# EAGLE design CNC-ControlsBoard (EAGLE 6.4)
CNC Control Panel Controls Board reads the MPG encoder displays the turns indicator for the MPG reads the Feed/Speed overrides reads the Keyboard and controls all but 5 of its LEDs displays Spindle Speed and Feed Rate SPI Slave interface to the main MCU
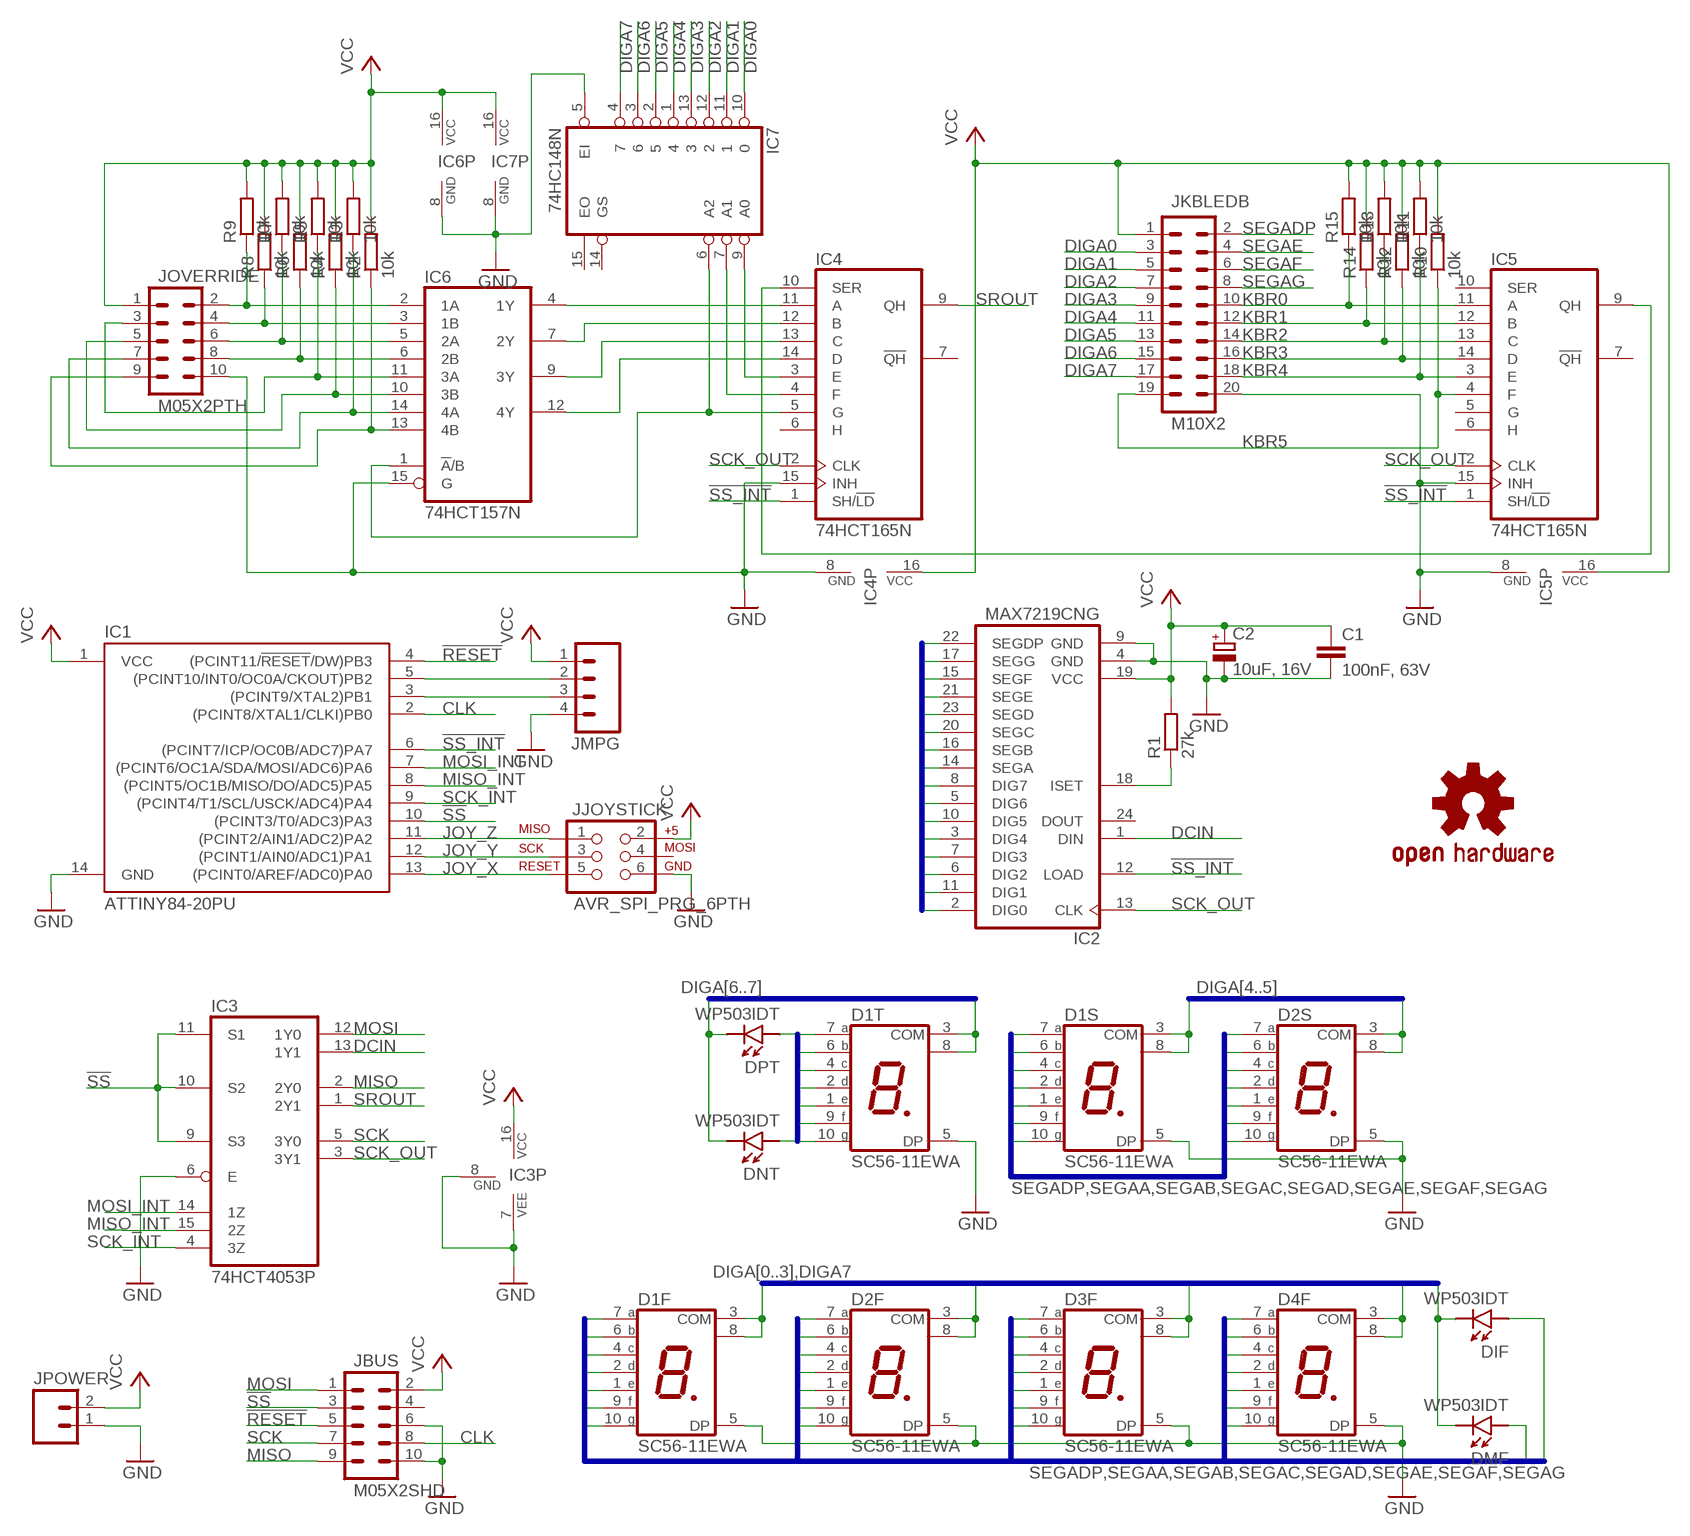
[diagram p0: schematic, sheet 1]

## Parts
C1  100nF, 63V  C-EU050-025X075  [C050-025X075]
C2  10uF, 16V  CPOL-EUE2,5-6E  [E2,5-6E]
D1F  SC56-11EWA  7-SEG_SA52-11  [SA52-11]
D1S  SC56-11EWA  7-SEG_SA52-11  [SA52-11]
D1T  SC56-11EWA  7-SEG_SA52-11  [SA52-11]
D2F  SC56-11EWA  7-SEG_SA52-11  [SA52-11]
D2S  SC56-11EWA  7-SEG_SA52-11  [SA52-11]
D3F  SC56-11EWA  7-SEG_SA52-11  [SA52-11]
D4F  SC56-11EWA  7-SEG_SA52-11  [SA52-11]
DIF  WP503IDT  [AXIAL__GENERIC_SQ_5X5]
DMF  WP503IDT  [AXIAL__GENERIC_SQ_5X5]
DNT  WP503IDT  [AXIAL__GENERIC_SQ_5X5]
DPT  WP503IDT  [AXIAL__GENERIC_SQ_5X5]
IC1  ATTINY84-20PU  [DIL14]
IC2  MAX7219CNG  [DIL24-3]
IC3  74HCT4053P  [DIL16]
IC4  74HCT165N  [DIL16]
IC5  74HCT165N  [DIL16]
IC6  74HCT157N  [DIL16]
IC7  74HC148N  [DIL16]
JBUS  M05X2SHD  [2X5-SHROUDED]
JJOYSTICK  AVR_SPI_PRG_6PTH  [2X3]
JKBLEDB  M10X2  [2X10]
JMPG  M04PTH  [1X04]
JOVERRIDE  M05X2PTH  [AVR_ICSP]
JPOWER  M02POLAR  [MOLEX-1X2]
R1  27k  R-EU_0207/10  [0207/10]
R2  10k  R-EU_0207/10  [0207/10]
R3  10k  R-EU_0207/10  [0207/10]
R4  10k  R-EU_0207/10  [0207/10]
R5  10k  R-EU_0207/10  [0207/10]
R6  10k  R-EU_0207/10  [0207/10]
R7  10k  R-EU_0207/10  [0207/10]
R8  10k  R-EU_0207/10  [0207/10]
R9  10k  R-EU_0207/10  [0207/10]
R10  10k  R-EU_0207/10  [0207/10]
R11  10k  R-EU_0207/10  [0207/10]
R12  10k  R-EU_0207/10  [0207/10]
R13  10k  R-EU_0207/10  [0207/10]
R14  10k  R-EU_0207/10  [0207/10]
R15  10k  R-EU_0207/10  [0207/10]
U$1  SPARKFUN_OSHW-LOGOL  [SPARKFUN_OSHW-LOGO-L]

## Nets
!RESET: IC1.4((PCINT11/!RESET!/DW)PB3) JBUS.5
!SS: IC1.10((PCINT3/T0/ADC3)PA3) IC3.9(S3) IC3.10(S2) IC3.11(S1) JBUS.3
!SS_INT: IC1.6((PCINT7/ICP/OC0B/ADC7)PA7) IC2.12(LOAD) IC4.1(SH/!LD) IC5.1(SH/!LD)
CLK: IC1.2((PCINT8/XTAL1/CLKI)PB0) JBUS.8
DCIN: IC2.1(DIN) IC3.13(1Y1)
DIGA0: D1F.3(COM) D1F.8(COM) IC2.2(DIG0) IC7.10 JKBLEDB.3
DIGA1: D2F.3(COM) D2F.8(COM) IC2.11(DIG1) IC7.11 JKBLEDB.5
DIGA2: D3F.3(COM) D3F.8(COM) IC2.6(DIG2) IC7.12 JKBLEDB.7
DIGA3: D4F.3(COM) D4F.8(COM) IC2.7(DIG3) IC7.13 JKBLEDB.9
DIGA4: D1S.3(COM) D1S.8(COM) IC2.3(DIG4) IC7.1 JKBLEDB.11
DIGA5: D2S.3(COM) D2S.8(COM) IC2.10(DIG5) IC7.2 JKBLEDB.13
DIGA6: D1T.3(COM) D1T.8(COM) IC2.5(DIG6) IC7.3 JKBLEDB.15
DIGA7: DIF.2(K) DMF.2(K) DNT.2(K) DPT.2(K) IC2.8(DIG7) IC7.4 JKBLEDB.17
FOA1: IC6.13(4B) JOVERRIDE.9 R2.1
FOB1: IC6.14(4A) JOVERRIDE.7 R3.1
FOC1: IC6.10(3B) JOVERRIDE.5 R4.1
FOD1: IC6.11(3A) JOVERRIDE.3 R5.1
GND: C1.2 C2.- D1F.5(DP) D1S.5(DP) D1T.5(DP) D2F.5(DP) D2S.5(DP) D3F.5(DP) D4F.5(DP) IC1.14(GND) IC2.4(GND) IC2.9(GND) IC3.6(E) IC3.7(VEE) IC3.8(GND) IC4.8(GND) IC4.15(INH) IC5.8(GND) IC5.15(INH) IC6.8(GND) IC6.15(G) IC7.5(EI) IC7.8(GND) JBUS.6 JBUS.10 JJOYSTICK.6 JKBLEDB.20 JMPG.4 JOVERRIDE.10 JPOWER.1
JOY_X: IC1.13((PCINT0/AREF/ADC0)PA0) JJOYSTICK.5
JOY_Y: IC1.12((PCINT1/AIN0/ADC1)PA1) JJOYSTICK.3
JOY_Z: IC1.11((PCINT2/AIN1/ADC2)PA2) JJOYSTICK.1
KBR0: IC5.11(A) JKBLEDB.10 R15.1
KBR1: IC5.12(B) JKBLEDB.12 R14.1
KBR2: IC5.13(C) JKBLEDB.14 R13.1
KBR3: IC5.14(D) JKBLEDB.16 R12.1
KBR4: IC5.3(E) JKBLEDB.18 R11.1
KBR5: IC5.4(F) JKBLEDB.19 R10.1
MISO: IC3.2(2Y0) JBUS.9
MISO_INT: IC1.8((PCINT5/OC1B/MISO/DO/ADC5)PA5) IC3.15(2Z)
MOSI: IC3.12(1Y0) JBUS.1
MOSI_INT: IC1.7((PCINT6/OC1A/SDA/MOSI/ADC6)PA6) IC3.14(1Z)
N$1: IC4.10(SER) IC5.9(QH)
N$2: IC4.11(A) IC6.4(1Y)
N$3: IC4.12(B) IC6.7(2Y)
N$4: IC1.5((PCINT10/INT0/OC0A/CKOUT)PB2) JMPG.2
N$5: IC1.3((PCINT9/XTAL2)PB1) JMPG.3
N$7: IC4.13(C) IC6.9(3Y)
N$8: IC4.14(D) IC6.12(4Y)
N$9: IC4.3(E) IC7.9(A0)
N$10: IC4.4(F) IC7.7(A1)
N$11: IC4.5(G) IC6.1(!A!/B) IC7.6(A2)
N$22: IC2.18(ISET) R1.1
SCK: IC3.5(3Y0) JBUS.7
SCK_INT: IC1.9((PCINT4/T1/SCL/USCK/ADC4)PA4) IC3.4(3Z)
SCK_OUT: IC2.13(CLK) IC3.3(3Y1) IC4.2(CLK) IC5.2(CLK)
SEGAA: D1F.7(A) D1S.7(A) D1T.7(A) D2F.7(A) D2S.7(A) D3F.7(A) D4F.7(A) DPT.1(A) IC2.14(SEGA)
SEGAB: D1F.6(B) D1S.6(B) D1T.6(B) D2F.6(B) D2S.6(B) D3F.6(B) D4F.6(B) DNT.1(A) IC2.16(SEGB)
SEGAC: D1F.4(C) D1S.4(C) D1T.4(C) D2F.4(C) D2S.4(C) D3F.4(C) D4F.4(C) DIF.1(A) IC2.20(SEGC)
SEGAD: D1F.2(D) D1S.2(D) D1T.2(D) D2F.2(D) D2S.2(D) D3F.2(D) D4F.2(D) DMF.1(A) IC2.23(SEGD)
SEGADP: IC2.22(SEGDP) JKBLEDB.2
SEGAE: D1F.1(E) D1S.1(E) D1T.1(E) D2F.1(E) D2S.1(E) D3F.1(E) D4F.1(E) IC2.21(SEGE) JKBLEDB.4
SEGAF: D1F.9(F) D1S.9(F) D1T.9(F) D2F.9(F) D2S.9(F) D3F.9(F) D4F.9(F) IC2.15(SEGF) JKBLEDB.6
SEGAG: D1F.10(G) D1S.10(G) D1T.10(G) D2F.10(G) D2S.10(G) D3F.10(G) D4F.10(G) IC2.17(SEGG) JKBLEDB.8
SOA1: IC6.6(2B) JOVERRIDE.8 R6.1
SOB1: IC6.5(2A) JOVERRIDE.6 R7.1
SOC1: IC6.3(1B) JOVERRIDE.4 R8.1
SOD1: IC6.2(1A) JOVERRIDE.2 R9.1
SROUT: IC3.1(2Y1) IC4.9(QH)
VCC: C1.1 C2.+ IC1.1(VCC) IC2.19(VCC) IC3.16(VCC) IC4.16(VCC) IC5.16(VCC) IC6.16(VCC) IC7.16(VCC) JBUS.2 JJOYSTICK.2 JKBLEDB.1 JMPG.1 JOVERRIDE.1 JPOWER.2 R1.2 R2.2 R3.2 R4.2 R5.2 R6.2 R7.2 R8.2 R9.2 R10.2 R11.2 R12.2 R13.2 R14.2 R15.2
Unconnected: IC2.24(DOUT) IC4.6(H) IC4.7(!QH) IC5.5(G) IC5.6(H) IC5.7(!QH) IC5.10(SER) IC7.14(GS) IC7.15(EO) JBUS.4 JJOYSTICK.4

## Buses
DIGA[0..7],SEGAA,SEGAB,SEGAC,SEGAD,SEGAE,SEGAF,SEGAG,SEGADP
SEGAA,SEGAB,SEGAC,SEGAD,SEGAE,SEGAF,SEGAG,SEGADP
DIGA[6..7]
DIGA[4..5]
DIGA[0..3],DIGA7
SEGADP,SEGAA,SEGAB,SEGAC,SEGAD,SEGAE,SEGAF,SEGAG

## Library data of the parts
C1 = rcl:C-EU: CAPACITOR, European symbol
C2 = rcl:CPOL-EU: POLARIZED CAPACITOR, European symbol
D1F D1S D1T D2F D2S D3F D4F = display-kingbright:7-SEG_: Kingbright 14.2mm (0.56 INCH) SINGLE DIGIT NUMERIC DUISPLAY Source: SA56-11EWA(Ver1189471036.pdf; OC_FARNELL: unknown; OC_NEWARK: unknown
DIF DMF DNT DPT = radu-collected:WP503*: Kingbright WP503 series 5mm square LEDs
IC1 = SparkFun-DigitalIC-mine:ATTINY84: Atmel 14-pin 2/4/8kB flash uC
IC2 = maxim:MAX7219CNG: LED DISPLAY DRIVER; MF: MAXIM; MPN: MAX7219CNG; OC_FARNELL: 1523914; OC_NEWARK: 34C4018
IC3 = 74xx-eu:74*4053: Triple 2-channel analog multiplexer/demultiplexer Philips Semiconductor
IC4 IC5 = 74xx-eu:74*165: 8-bit parallel load SHIFT REGISTER
IC6 = 74xx-eu:74*157: Quadruple 2-line to 1-line data SELECTOR/MULTIPLEXER
IC7 = 74xx-eu:74*148: 10-line to 4-line and 8-line to 3-line PRIORITY ENCODER
JBUS JOVERRIDE = SparkFun-Connectors:M05X2: Header 5x2 Standard 10-pin dual row 0.1" header. Commonly used with AVR-ISP. Use with Spark Fun Electronics SKU: PRT-00778
JJOYSTICK = SparkFun-Connectors:AVR_SPI_PRG_6: AVR ISP 6 Pin This is the reduced ISP connector for AVR programming. Common on Arduino. This footprint will take up less PCB space and can be used with a 10-pin to 6-pin adapter such as SKU: BOB-08508
JKBLEDB = SparkFun-Connectors:M10X2: This was SPECIALLY designed to be used with our Graphic LCD Backpack. Be sure you want to use this! It is not only staggered on each line of header holes, but IT IS ALSO offset of the center point of the top and bottom lines by 5 mil. This causes the headers to lock into place on the "standard" footprint on the LCD screen. The extra squares on the tdocu layer are there simply to reference other pins (if you were to actually populate a longer header than ten long - this is what we do with the backpacks).
JMPG = SparkFun-Connectors:M04: Header 4 Standard 4-pin 0.1" header. Use with straight break away headers (SKU : PRT-00116), right angle break away headers (PRT-00553), swiss pins (PRT-00743), machine pins (PRT-00117), and female headers (PRT-00115). Molex polarized connector foot print use with SKU : PRT-08231 with associated crimp pins and housings. 1MM SMD Version SKU: PRT-10208
JPOWER = SparkFun-Connectors:M02: Header 2 Standard 2-pin 0.1" header. Use with straight break away headers (SKU : PRT-00116), right angle break away headers (PRT-00553), swiss pins (PRT-00743), machine pins (PRT-00117), and female headers (PRT-00115). Molex polarized connector foot print use with SKU : PRT-08233 with associated crimp pins and housings.
R1-R15 = rcl:R-EU_: RESISTOR, European symbol
U$1 = Si4735_Breakout-v10:SPARKFUN_OSHW-LOGO: Open Source Hardware Logo This logo indicates the piece of hardware it is found on incorporates a OSHW license and/or adheres to the definition of open source hardware found here: http://freedomdefined.org/OSHW

## Net classes
1 Power: width 1.27 mm

## Board
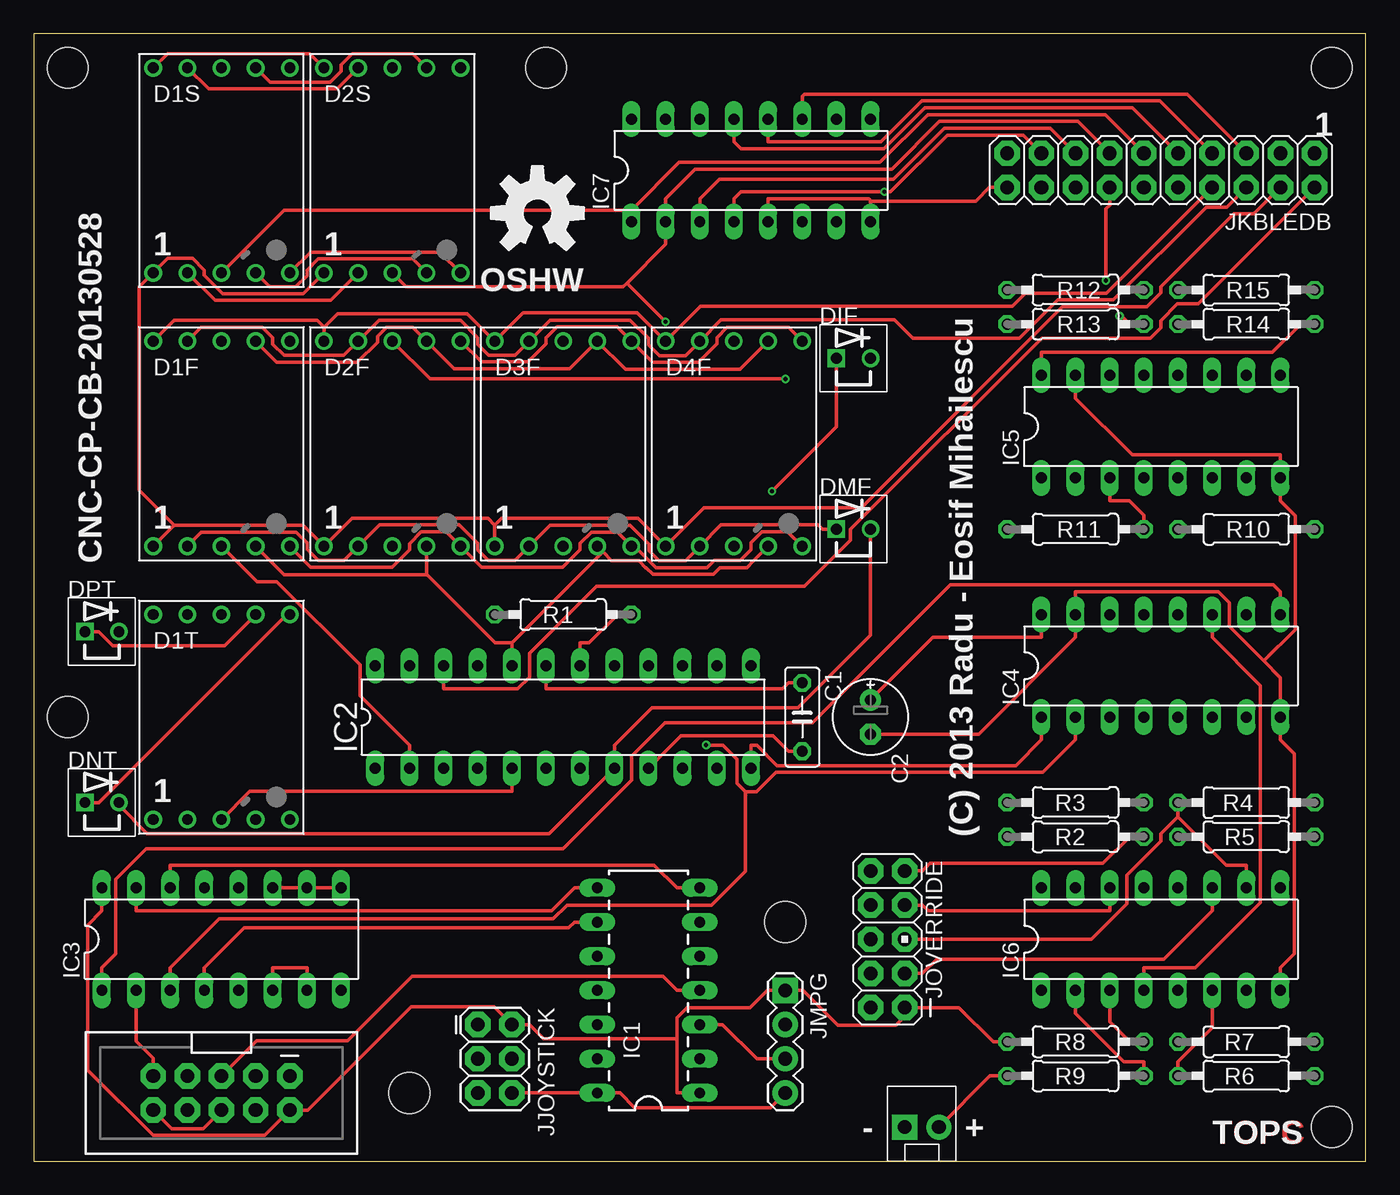
[diagram p1: board, top side]
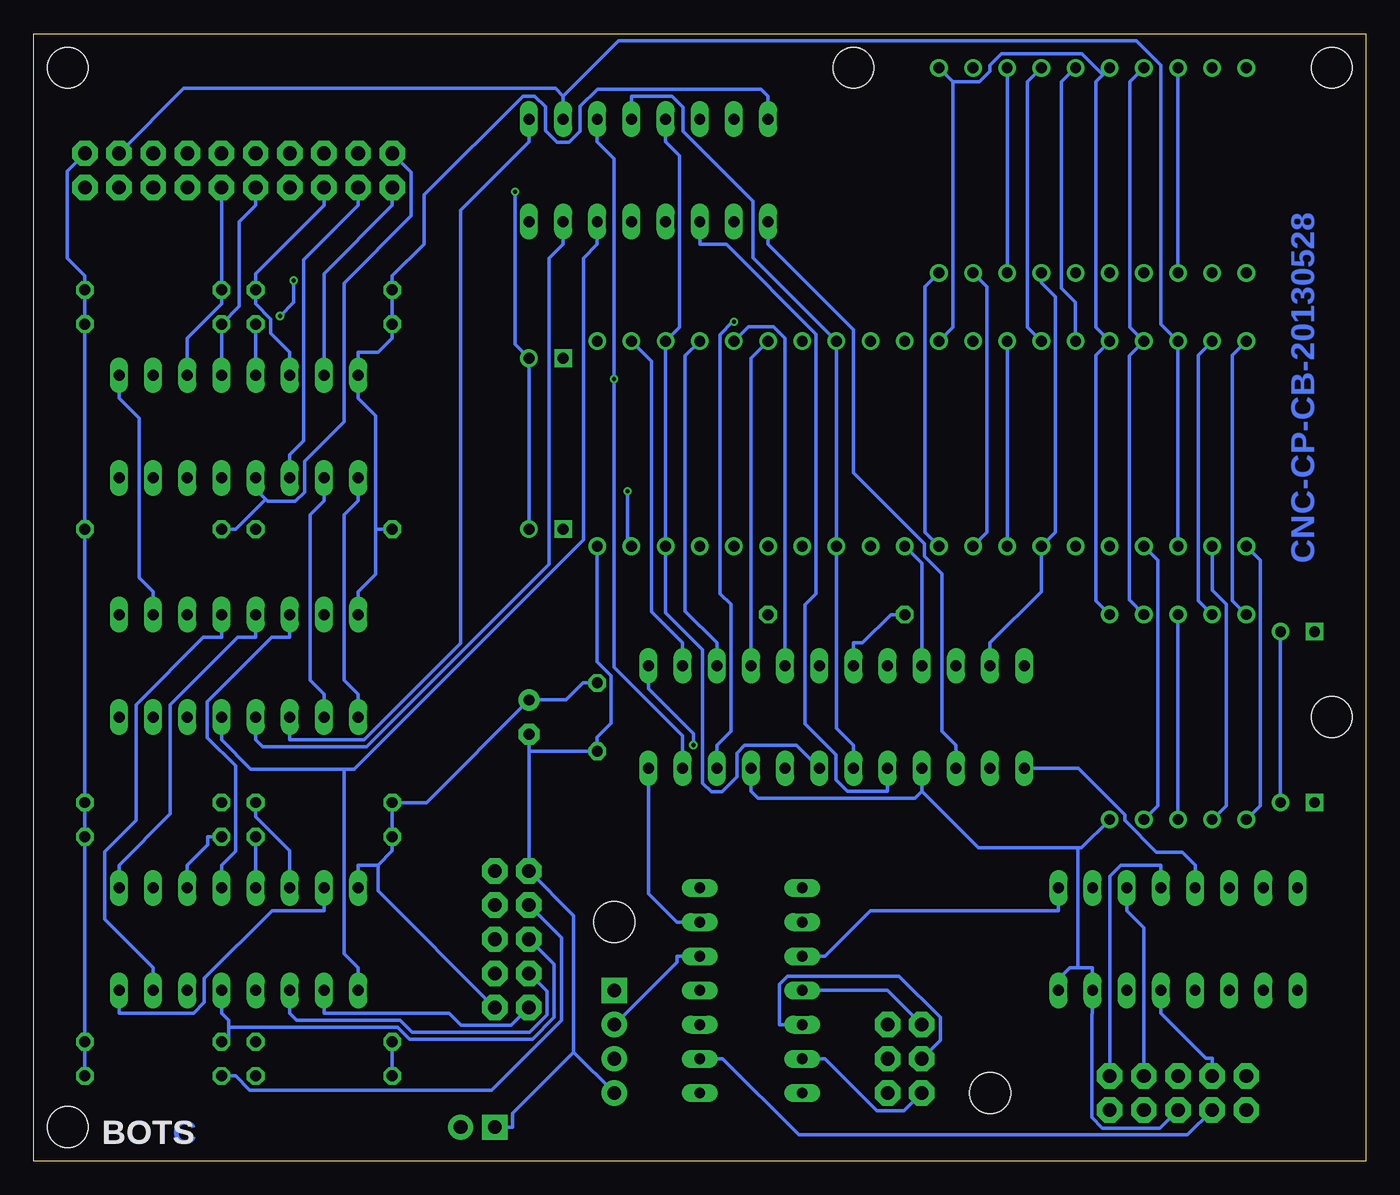
[diagram p2: board, bottom side, seen from below]

Size 99.06 x 83.82 mm. Coordinates in mm from the lower left corner, seen from the top.
Outline: 0,0 99.06,0 99.06,83.82 0,83.82 0,0
Copper layers (1*16): Top 0.035mm / dielectric 1.5mm / Bottom 0.035mm
Design rules "ITEADstudio_DRC": minimum track width 10mil, minimum drill 12mil, track to track 10mil, track to pad 10mil, pad to pad 10mil, via to via 10mil, smd to smd 0mil, copper to edge 20mil, drill to drill 10mil, minimum pad ring 10mil, minimum via ring 6mil, stop-mask expansion 4mil, vias tented up to drill 100mil, thermal gap 10mil
Holes 3.05 mm at 96.52,81.28 96.52,2.54 2.54,33.02 2.54,81.28 27.94,5.08 55.88,17.78 38.1,81.28

### Footprints (pad centres in the part's own frame; a part is rotated, then mirrored left to right if it is on the bottom)
C050-025X075 = drill 0.813 octagon: 1 -2.54,0; 2 2.54,0
E2,5-6E = drill 0.813 pad 1.575: + -1.27,0 | drill 0.813 pad 1.575 octagon: - 1.27,0
SA52-11 = drill 0.8: 1 -5.08,-7.62; 2 -2.54,-7.62; 3 0,-7.62; 4 2.54,-7.62; 5 5.08,-7.62; 6 5.08,7.62; 7 2.54,7.62; 8 0,7.62; 9 -2.54,7.62; 10 -5.08,7.62
AXIAL__GENERIC_SQ_5X5 = drill 0.8 square: 1 -1.27,0 | drill 0.8: 2 1.27,0
DIL14 = drill 0.813 long: 1 -8.89,-3.81; 2 -6.35,-3.81; 3 -3.81,-3.81; 4 -1.27,-3.81; 5 1.27,-3.81; 6 3.81,-3.81; 7 6.35,-3.81; 8 6.35,3.81; 9 3.81,3.81; 10 1.27,3.81; 11 -1.27,3.81; 12 -3.81,3.81; 13 -6.35,3.81; 14 -8.89,3.81
DIL24-3 = drill 0.813 long: 1 -13.97,-3.81; 2 -11.43,-3.81; 3 -8.89,-3.81; 4 -6.35,-3.81; 5 -3.81,-3.81; 6 -1.27,-3.81; 7 1.27,-3.81; 8 3.81,-3.81; 9 6.35,-3.81; 10 8.89,-3.81; 11 11.43,-3.81; 12 13.97,-3.81; 13 13.97,3.81; 14 11.43,3.81; 15 8.89,3.81; 16 6.35,3.81; 17 3.81,3.81; 18 1.27,3.81; 19 -1.27,3.81; 20 -3.81,3.81; 21 -6.35,3.81; 22 -8.89,3.81; 23 -11.43,3.81; 24 -13.97,3.81
DIL16 = drill 0.813 long: 1 -8.89,-3.81; 2 -6.35,-3.81; 3 -3.81,-3.81; 4 -1.27,-3.81; 5 1.27,-3.81; 6 3.81,-3.81; 7 6.35,-3.81; 8 8.89,-3.81; 9 8.89,3.81; 10 6.35,3.81; 11 3.81,3.81; 12 1.27,3.81; 13 -1.27,3.81; 14 -3.81,3.81; 15 -6.35,3.81; 16 -8.89,3.81
2X5-SHROUDED = drill 1.016 pad 1.88 octagon: 1 -1.27,5.08; 2 1.27,5.08; 3 -1.27,2.54; 4 1.27,2.54; 5 -1.27,0; 6 1.27,0; 7 -1.27,-2.54; 8 1.27,-2.54; 9 -1.27,-5.08; 10 1.27,-5.08
2X3 = drill 1.016 pad 1.88 octagon: 1 0,0; 2 0,2.54; 3 2.54,0; 4 2.54,2.54; 5 5.08,0; 6 5.08,2.54
2X10 = drill 1.016 pad 1.88 octagon: 1 -11.43,-1.27; 2 -11.43,1.27; 3 -8.89,-1.27; 4 -8.89,1.27; 5 -6.35,-1.27; 6 -6.35,1.27; 7 -3.81,-1.27; 8 -3.81,1.27; 9 -1.27,-1.27; 10 -1.27,1.27; 11 1.27,-1.27; 12 1.27,1.27; 13 3.81,-1.27; 14 3.81,1.27; 15 6.35,-1.27; 16 6.35,1.27; 17 8.89,-1.27; 18 8.89,1.27; 19 11.43,-1.27; 20 11.43,1.27
1X04 = drill 1.016 pad 1.88 square: 1 0,0 | drill 1.016 pad 1.88: 2 2.54,0; 3 5.08,0; 4 7.62,0
AVR_ICSP = drill 1.016 pad 1.88 octagon: 1 -1.27,5.08; 2 1.27,5.08; 3 -1.27,2.54; 4 1.27,2.54; 5 -1.27,0; 6 1.27,0; 7 -1.27,-2.54; 8 1.27,-2.54; 9 -1.27,-5.08; 10 1.27,-5.08
MOLEX-1X2 = drill 1.016 pad 1.88 square: 1 0,0 | drill 1.016 pad 1.88: 2 2.54,0
0207/10 = drill 0.813 octagon: 1 -5.08,0; 2 5.08,0

### Placement (x,y rotation side)
C1  57.15,33.02 270 top
C2  62.23,33.02 270 top
D1F  13.97,53.34 0 top
D1S  13.97,73.66 0 top
D1T  13.97,33.02 0 top
D2F  26.67,53.34 0 top
D2S  26.67,73.66 0 top
D3F  39.37,53.34 0 top
D4F  52.07,53.34 0 top
DIF  60.96,59.69 0 top
DMF  60.96,46.99 0 top
DNT  5.08,26.67 0 top
DPT  5.08,39.37 0 top
IC1  45.72,13.97 90 top
IC2  39.37,33.02 0 top
IC3  13.97,16.51 0 top
IC4  83.82,36.83 0 top
IC5  83.82,54.61 0 top
IC6  83.82,16.51 0 top
IC7  53.34,73.66 0 top
JBUS  13.97,5.08 270 top
JJOYSTICK  33.02,10.16 270 top
JKBLEDB  83.82,73.66 180 top
JMPG  55.88,12.7 270 top
JOVERRIDE  63.5,16.51 180 top
JPOWER  64.77,2.54 0 top
R1  39.37,40.64 180 top
R2  77.47,24.13 180 top
R3  77.47,26.67 180 top
R4  90.17,26.67 0 top
R5  90.17,24.13 0 top
R6  90.17,6.35 0 top
R7  90.17,8.89 0 top
R8  77.47,8.89 180 top
R9  77.47,6.35 180 top
R10  90.17,46.99 0 top
R11  77.47,46.99 180 top
R12  77.47,64.77 180 top
R13  77.47,62.23 180 top
R14  90.17,62.23 0 top
R15  90.17,64.77 0 top
U$1  37.47,70.48 0 top

### Tracks (layer width: path | path; a pad name or v marks a point on that pad's centre or on a via)
!RESET
  Top 0.254: IC1.4 47.83,12.7 46.79,13.74 28.13,13.74 23.34,8.95 16.57,8.95 JBUS.5
!SS
  Top 0.254: IC3.9 IC3.10 IC3.11
  Bottom 0.254: IC1.10 40.21,15.24 36.83,18.62 22.86,18.62 IC3.9 | IC3.11 17.78,18.62 16.51,17.35 JBUS.3
!SS_INT
  Top 0.254: IC2.12 53.34,30.91 53.77,30.91 55.27,29.41 73.03,29.41 74.93,31.32 IC4.1
  Bottom 0.254: IC4.1 74.93,34.72 75.97,35.76 75.97,48.06 74.93,49.1 IC5.1 | IC1.6 51.23,17.78 53.34,19.89 IC2.12
CLK
  Bottom 0.254: JBUS.8 13.28,1.96 42.17,1.96 47.83,7.62 IC1.2
DCIN
  Bottom 0.254: IC3.13 12.7,22.02 13.66,22.98 15.57,22.98 17.93,25.34 17.93,25.74 21.4,29.21 IC2.1
DIGA0
  Top 0.254: IC2.2 27.94,30.91 24.26,34.59 24.26,36.89 18.07,43.08 16.61,43.08 D1F.3
  Bottom 0.254: JKBLEDB.3 87.9,79.74 60.26,79.74 59.69,79.17 | 59.69,79.17 55.56,83.3 17.06,83.3 15.24,81.48 15.24,62.23 D1F.8 D1F.3 | 59.69,79.17 59.69,79.05 IC7.10
DIGA1  (via drill 0.3 pad 0.61)
  Top 0.254: JKBLEDB.5 85.77,79.33 57.31,79.33 57.15,79.17 IC7.11 | v55.89,58.15 29.48,58.15 D2F.8
  Bottom 0.254: D2F.8 D2F.3 | IC7.11 57.15,75.77 55.89,74.51 v55.89,58.15 55.89,36.72 50.8,31.63 50.8,30.91 IC2.11
DIGA2
  Top 0.254: JKBLEDB.7 83.74,78.82 66.06,78.82 63.02,75.77 54.61,75.77 IC7.12
  Bottom 0.254: IC2.6 38.1,30.91 39.37,32.18 D3F.3 D3F.8 45.56,67.16 45.56,71.36 50.77,76.56 50.77,78.34 51.61,79.17 54.61,79.17 IC7.12
DIGA3
  Top 0.254: JKBLEDB.9 81.71,78.31 66.28,78.31 63.22,75.26 52.58,75.26 52.07,75.77 IC7.13
  Bottom 0.254: IC2.7 42.34,30.91 46.2,30.91 46.77,30.35 46.77,28.57 47.88,27.46 48.67,27.46 49.32,28.11 49.32,38.02 52.07,40.77 D4F.3 D4F.8 51.03,62 51.03,74.73 52.07,75.77 IC7.13
DIGA4
  Top 0.254: 44.45,70.7 18.63,70.7 D1S.3 | JKBLEDB.11 79.68,77.8 66.49,77.8 62.93,74.24 47.99,74.24 44.45,70.7 | IC7.1 44.45,70.7
  Bottom 0.254: IC7.1 44.45,68.15 38.1,61.8 38.1,51.17 32.84,45.91 32.84,44.99 31.52,43.67 31.52,31.95 30.48,30.91 IC2.3 | D1S.8 D1S.3
DIGA5  (via drill 0.3 pad 0.61)
  Top 0.254: JKBLEDB.13 77.65,77.29 67.36,77.29 63.8,73.74 49.17,73.74 46.99,71.55 IC7.2 46.99,68.15 44.12,65.28 | 44.12,65.28 43.84,65 27.71,65 D2S.3 | 44.12,65.28 v46.99,62.4
  Bottom 0.254: IC2.10 48.26,30.91 47.21,31.96 47.21,41.39 48.02,42.2 48.02,61.46 47.08,62.4 v46.99,62.4 | D2S.8 D2S.3
DIGA6
  Top 0.254: JKBLEDB.15 75.61,76.78 67.73,76.78 63.95,73 50.98,73 49.53,71.55 IC7.3 | IC2.5 35.56,27.51 16.08,27.51 D1T.3
  Bottom 0.254: IC2.5 35.56,27.51 38.54,27.51 39.41,28.38 39.41,30.21 41.72,32.52 41.72,41.36 40.87,42.21 40.87,61.47 47.55,68.15 49.53,68.15 IC7.3 | D1T.8 D1T.3
DIGA7  (via drill 0.3 pad 0.61)
  Top 0.254: DNT.2 6.35,26.45 8.46,24.34 38.31,24.34 IC2.8 43.18,30.91 45.98,33.71 56.82,33.71 62.23,39.12 DMF.2 | JKBLEDB.17 73.58,76.28 67.94,76.28 63.73,72.06 v63.27,72.06 52.58,72.06 52.07,71.55 IC7.4
  Bottom 0.254: DNT.2 DPT.2 | v63.27,72.06 63.27,60.73 DIF.2 DMF.2
FOA1
  Top 0.254: JOVERRIDE.9 66.09,21.59 66.64,22.14 79.52,22.14 81.51,24.13 R2.1
  Bottom 0.254: R2.1 IC6.13
FOB1
  Top 0.254: JOVERRIDE.7 66.09,19.05 66.52,18.62 80.01,18.62 IC6.14
  Bottom 0.254: R3.1 82.55,25.63 80.01,23.09 IC6.14
FOC1
  Top 0.254: JOVERRIDE.5 78.65,16.51 81.28,19.14 81.28,21.27 83.82,23.81 83.82,24.36 85.09,25.63 | IC6.10 90.17,22.02 88.7,22.02 85.09,25.63 | R4.1 85.09,25.63
FOD1
  Top 0.254: JOVERRIDE.3 66.09,13.97 67.15,15.03 84.04,15.03 87.63,18.62 IC6.11
  Bottom 0.254: R5.1 86.13,24.13 86.13,23.52 87.63,22.02 IC6.11
GND
  Top 0.254: IC2.9 48.14,31.63 54.96,31.63 56.11,30.48 C1.2 | D4F.5 56.07,46.8 54.17,46.8 53.34,45.97 53.34,45.47 52.55,44.69 50.63,44.69 50.08,44.14 46.28,44.14 44.69,45.72 D3F.5 43.41,46.77 41.47,46.77 40.64,45.94 40.64,45.47 39.34,44.17 33.3,44.17 D2F.5 30.68,46.79 28.82,46.79 27.94,45.92 27.94,45.44 26.65,44.16 20.61,44.16 D1F.5 | IC5.15 77.47,56.72 81.69,52.5 92.71,52.5 IC5.8 92.71,50.42 92.71,49.1 93.81,48 93.81,39.53 91.47,37.19 | 91.47,37.19 92.71,35.95 IC4.8 92.71,31.32 93.75,30.28 93.75,15.44 92.71,14.4 IC6.8 | 91.47,37.19 88.9,39.76 88.9,41.53 88.09,42.34 77.47,42.34 IC4.15 77.47,40.26 77.47,38.94 70.28,31.75 63.4,31.75 C2.- | 62.23,71.42 62.28,71.37 70.05,71.37 71.07,72.39 JKBLEDB.20 | IC7.5 54.61,71.55 62.1,71.55 62.23,71.42 | IC7.8 62.23,71.42 | JMPG.4 54.8,4 44.69,4 43.61,5.08 IC1.14 JJOYSTICK.6 | D2S.5 30.2,67.58 20.6,67.58 D1S.5 | IC3.6 17.78,14.4 20.32,14.4 IC3.7 | JBUS.10 10.26,2.44 12.6,2.44 JBUS.6
  Bottom 0.254: IC6.15 77.47,18.62 81.34,18.62 86.36,13.6 86.36,11.81 87.17,11 92.71,11 IC6.8 | 21.4,23.29 28.8,23.29 33.02,27.51 | 21.4,23.29 21.16,23.29 D1T.5 | 21.4,14.4 21.4,23.29 | 33.02,27.51 33.53,27 45.21,27 45.72,27.51 IC2.9 | IC2.4 33.02,27.51 | 21.4,14.4 20.32,14.4 IC3.7 20.32,11 20.38,10.94 20.38,3.26 19.59,2.47 15.31,2.47 JBUS.6 | 21.4,14.4 22.01,14.4 22.86,13.55 IC3.8 | D2S.5 32.79,65 32.79,46.76 D2F.5 | IC5.15 77.47,65.99 72.39,71.07 JKBLEDB.20 | 62.23,30.48 62.23,30.58 C2.- | 62.23,30.48 JOVERRIDE.10 58.91,18.27 58.91,8.11 | 62.23,30.48 C1.2 57.15,31.52 56.11,32.56 56.11,36.09 57.15,37.13 D4F.5 | JPOWER.1 63.45,2.54 63.45,3.56 58.91,8.11 | JMPG.4 58.91,8.11
JOY_X
  Bottom 0.254: IC1.13 40.21,7.62 36.34,3.75 34.35,3.75 JJOYSTICK.5
JOY_Y
  Bottom 0.254: IC1.12 43.61,10.16 43.61,13.15 43,13.76 34.71,13.76 31.64,10.69 31.64,8.99 JJOYSTICK.3
JOY_Z
  Bottom 0.254: JJOYSTICK.1 35.56,12.7 IC1.11
KBR0
  Bottom 0.254: IC5.11 87.63,61.19 85.09,63.73 R15.1 JKBLEDB.10
KBR1
  Bottom 0.254: JKBLEDB.12 82.55,71.07 83.77,69.85 83.77,63.55 R14.1 85.09,60.12 IC5.12
KBR2  (via drill 0.3 pad 0.61)
  Top 0.254: v79.73,65.47 79.73,70.79 80.01,71.07 JKBLEDB.14 | v79.73,65.47 | R13.1 81.51,62.23 80.91,62.83 v80.74,62.83
  Bottom 0.254: v80.74,62.83 79.73,63.84 v79.73,65.47 | IC5.13 R13.1
KBR3
  Bottom 0.254: IC5.14 80.01,60.12 81.43,61.54 81.43,62.61 82.55,63.73 R12.1 82.55,65.81 82.55,65.99 77.47,71.07 JKBLEDB.16
KBR4
  Top 0.254: IC5.3 80.01,49.1 81.48,49.1 82.55,48.03 R11.1
  Bottom 0.254: JKBLEDB.18 74.93,71.07 78.97,67.03 78.97,53.54 80.01,52.5 IC5.3
KBR5
  Bottom 0.254: 81.82,49.22 81.65,49.05 79.62,49.05 78.92,49.75 78.92,52.04 75.99,54.97 75.99,65.27 70.99,70.27 70.99,73.53 JKBLEDB.19 | 81.82,49.22 82.34,49.74 82.55,49.95 IC5.4 | 81.82,49.22 84.05,46.99 R10.1
MISO
  Top 0.254: JBUS.9 8.89,7.67 7.62,8.94 IC3.2
MISO_INT
  Top 0.254: IC1.8 40.21,20.32 38.51,18.62 7.62,18.62 IC3.15
MOSI
  Bottom 0.254: IC3.12 15.24,22.02 18.21,22.02 19.05,21.19 JBUS.1
MOSI_INT
  Top 0.254: IC1.7 47.83,20.32 46.13,22.02 10.16,22.02 IC3.14
N$1
  Bottom 0.254: IC4.10 90.17,42.34 91.21,43.38 91.21,55.22 92.71,56.72 IC5.9
N$2
  Top 0.254: IC4.11 87.63,38.94 91.22,35.34 91.22,19.23 86.39,14.4 82.55,14.4 IC6.4
N$3
  Bottom 0.254: IC4.12 85.09,38.94 86.44,38.94 91.44,33.94 91.44,25.34 93.76,23.02 93.76,17.99 90.17,14.4 IC6.7
N$4
  Bottom 0.254: IC1.5 51.23,15.24 51.23,14.81 JMPG.2
N$5
  Top 0.254: IC1.3 51.23,10.16 53.77,7.62 JMPG.3
N$7
  Bottom 0.254: IC4.13 82.55,38.94 83.9,38.94 88.9,33.94 88.9,25.83 92.71,22.02 IC6.9
N$8
  Bottom 0.254: IC4.14 80.01,38.94 81.36,38.94 86.14,34.16 86.14,31.48 84.05,29.39 84.05,23.06 85.09,22.02 IC6.12
N$9
  Bottom 0.254: IC4.3 80.01,31.32 74.5,31.32 67.31,38.51 67.31,70.69 62.23,75.77 IC7.9
N$10
  Bottom 0.254: IC4.4 82.55,31.32 82.04,30.81 74.29,30.81 60.73,44.37 60.73,67.11 59.69,68.15 IC7.7
N$11
  Bottom 0.254: 75.97,29.16 75.22,29.16 58.19,46.19 58.19,67.11 57.15,68.15 IC7.6 | 75.97,29.16 82.93,29.16 85.09,31.32 IC4.5 | 75.97,29.16 75.97,15.44 74.93,14.4 IC6.1
N$22
  Top 0.254: IC2.18 40.64,38.53 41.3,38.53 43.41,40.64 R1.1
SCK
  Bottom 0.254: JBUS.7 11.43,7.67 11.91,7.67 15.24,11 IC3.5
SCK_INT
  Top 0.254: IC1.9 40.21,17.78 39.78,17.35 15.65,17.35 12.7,14.4 IC3.4
SCK_OUT  (via drill 0.3 pad 0.61)
  Top 0.254: 52.93,27.47 52.3,28.1 52.3,29.9 51.26,30.94 v50.01,30.94 | IC4.2 77.47,31.32 75.06,28.91 55.18,28.91 53.74,27.47 52.93,27.47 | IC3.3 10.16,14.4 13.79,18.03 38.64,18.03 39.66,19.05 50.4,19.05 52.93,21.58 52.93,27.47
  Bottom 0.254: v50.01,30.94 50.01,31.8 53.34,35.13 IC2.13 | IC4.2 77.47,34.72 78.51,35.76 78.51,48.06 77.47,49.1 IC5.2
SEGAA
  Top 0.254: D4F.7 52.53,58.88 43.99,58.88 D3F.7 39.86,58.91 31.26,58.91 D2F.7 28.17,62 26.24,62 25.57,61.32 25.57,60.88 24.07,59.39 18.08,59.39 D1F.7 | DPT.1 4.84,39.37 5.88,38.34 14.21,38.34 D1T.7 | D2S.7 28.16,82.33 23.68,82.33 22.86,81.51 22.86,81.03 22.04,80.21 17.58,80.21 D1S.7
  Bottom 0.254: IC2.14 50.8,38.53 53.1,40.84 53.1,59.45 D4F.7 | D1S.7 17.55,80.24 17.55,62 D1F.7 17.59,59.88 17.59,41.72 D1T.7
SEGAB
  Top 0.254: D4F.6 56.11,62 51.57,62 50.8,61.23 50.8,60.76 49.43,59.38 46.02,59.38 D3F.6 43.39,62.02 38.91,62.02 38.1,61.21 38.1,60.76 36.75,59.41 33.3,59.41 D2F.6 | DNT.1 4.84,26.67 18.82,40.64 D1T.6
  Bottom 0.254: IC2.16 45.72,59.69 D3F.6 | 30.71,80.24 D2S.6 | D2F.6 30.71,62 30.71,80.24 | 30.71,80.24 28.72,80.24 27.94,81.02 27.94,81.49 27.11,82.32 21.13,82.32 19.57,80.76 | 19.57,80.76 D1S.6 | 19.57,80.76 20.09,80.24 20.09,62 D1F.6 20.09,59.92 20.09,41.68 D1T.6
SEGAC  (via drill 0.3 pad 0.61)
  Top 0.254: 42.33,45.3 42.99,44.64 45,44.64 45.51,44.14 45.55,44.14 46.06,43.63 50.54,43.63 51.05,44.14 53.02,44.14 53.53,44.64 D4F.4 | 29.21,43.65 29.15,43.59 18.64,43.59 D1F.4 | 29.21,43.65 34.33,38.53 35.56,38.53 | D2F.4 29.21,43.65 | v54.9,49.8 59.69,54.59 DIF.1 | 42.33,45.3 D3F.4 | 42.33,45.3 35.56,38.53 | IC2.20 35.56,38.53 | D1S.4 17.55,65 19.49,65 20.32,65.83 20.32,66.24 21.16,67.08 28.17,67.08 D2S.4
  Bottom 0.254: D1T.4 15.47,26.44 15.47,44.68 D1F.4 | D4F.4 54.9,46.01 v54.9,49.8 | D2F.4 28.17,46.76 28.17,65 D2S.4
SEGAD
  Top 0.254: DMF.1 58.66,46.99 58.34,47.31 51.12,47.31 D4F.2 48.45,44.64 46.52,44.64 45.77,45.39 45.77,45.87 44.36,47.27 38.38,47.27 D3F.2 35.79,44.68 33.8,44.68 33.02,45.46 33.02,45.93 31.65,47.3 25.71,47.3 D2F.2 23.08,44.67 21.15,44.67 20.32,45.49 20.32,45.97 19.53,46.76 12.47,46.76 D1F.2 | D1S.2 13.48,63.99 22.08,63.99 D2S.2
  Bottom 0.254: IC2.23 27.94,38.53 24.13,42.34 D2F.2 23.09,46.76 23.09,64.28 24.13,65.32 D2S.2 | D1F.2 11.43,42.46 10.39,41.42 10.39,26.44 D1T.2
SEGADP
  Top 0.254: IC2.22 30.48,35.13 36,35.13 36.87,35.99 36.87,37.76 41.87,42.76 57.33,42.76 60.74,46.17 60.74,46.97 74.95,61.18 83.02,61.18 83.82,61.97 83.82,62.49 85.05,63.73 86.59,63.73 JKBLEDB.2
SEGAE
  Top 0.254: 34.29,47.3 34.78,47.78 44.93,47.78 D4F.1 49.84,48.57 61.56,48.57 76.51,63.52 82.77,63.52 83.82,64.56 83.82,64.99 89.24,70.41 90.73,70.41 JKBLEDB.4 | 34.29,47.3 33.77,47.81 23.68,47.81 D2F.1 20.04,47.27 10.44,47.27 | D3F.1 34.29,47.3 | D1F.1 10.44,47.27 | 10.44,47.27 7.84,49.86 7.84,64.99 D1S.1 9.96,67.11 11.84,67.11 12.7,66.25 12.7,65.84 14.05,64.5 20.05,64.5 D2S.1
  Bottom 0.254: IC2.21 33.02,38.53 33.02,44.45 D3F.1 | D1T.1 7.84,26.45 7.84,44.67 D1F.1
SEGAF
  Top 0.254: D1F.9 12.47,62 17.01,62 17.78,61.23 17.78,60.74 18.62,59.9 23.07,59.9 D2F.9 25.68,62.51 31.74,62.51 33.02,61.23 33.02,60.75 33.85,59.92 35.79,59.92 D3F.9 38.4,62.53 44.36,62.53 45.72,61.17 45.72,60.71 46.54,59.89 48.46,59.89 D4F.9 51.13,62.56 64,62.56 65.37,61.18 73.31,61.18 76.14,64.02 80.29,64.02 87.19,70.92 88.7,70.92 JKBLEDB.6 | D1S.9 13.01,79.7 22.55,79.7 D2S.9
  Bottom 0.254: D2S.9 25.17,80.24 25.17,62 D2F.9 | D1T.9 12.47,41.68 12.47,59.92 D1F.9 | D4F.9 50.61,59.88 50.61,40.88 48.26,38.53 IC2.15
SEGAG
  Top 0.254: JKBLEDB.8 79.77,64.53 73.73,64.53 72.77,63.57 49.6,63.57 D4F.10 44.88,63.07 36.4,63.07 D3F.10 32.24,63.01 22.6,63.01 21.59,62 | 21.59,62 21.08,62.51 10.44,62.51 D1F.10 | 21.59,62 D2F.10 | D2S.10 20.53,82.34 9.95,82.34 D1S.10
  Bottom 0.254: IC2.17 43.18,38.53 43.18,61.16 44.05,62.04 45.91,62.04 D4F.10 | D2S.10 22.64,80.23 22.64,64.91 21.59,63.86 D2F.10 | D1F.10 9.93,59.92 9.93,41.68 D1T.10
SOA1
  Top 0.254: R6.1 85.09,7.39 87.63,9.93 IC6.6
  Bottom 0.254: R6.1 84.05,6.35 82.99,5.29 65.02,5.29 59.81,10.5 59.81,16.63 JOVERRIDE.8
SOB1
  Bottom 0.254: 84.57,9.96 71.98,9.96 71.11,9.09 61.98,9.09 60.38,10.69 60.38,14.66 JOVERRIDE.6 | 84.57,9.96 84.57,10.48 85.09,11 IC6.5 | 84.57,9.96 84.57,8.89 R7.1
SOC1
  Top 0.254: R8.1 81.51,8.89 80.01,10.39 80.01,11 IC6.3
  Bottom 0.254: IC6.3 80.01,11 79.5,10.49 71.8,10.49 70.91,9.6 62.19,9.6 60.88,10.9 60.88,12.62 JOVERRIDE.4
SOD1
  Top 0.254: IC6.2 77.47,11 81.08,7.39 82.55,7.39 R9.1
  Bottom 0.254: JOVERRIDE.2 63.55,10.11 67.28,10.11 68.17,11 77.47,11 IC6.2
SROUT
  Top 0.254: IC3.1 5.08,14.4 6.12,15.44 6.12,20.97 8.38,23.23 39.36,23.23 44.45,28.32 44.45,30.1 46.94,32.59 57.9,32.59 68.17,42.86 92.19,42.86 92.71,42.34 IC4.9
VCC
  Top 0.254: C2.+ 66.88,38.94 74.93,38.94 IC4.16 | 47.83,9.12 47.83,5.08 IC1.1 | 47.83,9.12 47.83,10.65 48.58,11.4 53.26,11.4 54.56,12.7 JMPG.1 57.2,12.7 59.8,10.1 64.1,10.1 65.43,11.43 | 47.83,9.12 37.92,9.12 36.88,10.16 JJOYSTICK.2 34.23,11.49 28.05,11.49 20.37,3.81 JBUS.2 17.17,1.93 8.88,1.93 4.03,6.79 4.03,17.56 5.08,18.62 IC3.16 | R8.2 71.35,8.89 68.81,11.43 65.43,11.43 | JOVERRIDE.1 65.43,11.43 | R9.2 71.12,6.35 JPOWER.2 | IC5.16 74.93,60.12 92.1,60.12 94.21,62.23 R14.2 | IC2.19 38.1,35.13 55.68,35.13 56.11,35.56 C1.1
  Bottom 0.254: IC7.16 44.45,79.17 44.97,79.69 57.14,79.69 58.42,78.41 58.42,76.57 59.24,75.74 60.14,75.74 61,76.6 61,78.37 61.81,79.18 62.68,79.18 70.03,71.83 70.03,68.17 72.39,65.81 R12.2 R13.2 72.39,61.19 73.46,60.12 74.93,60.12 74.93,59.27 IC5.16 74.93,56.72 73.62,55.41 73.62,46.99 | R1.2 35.33,40.64 37.44,38.53 38.1,38.53 IC2.19 | JKBLEDB.1 96.57,73.61 96.57,67.14 95.25,65.81 R15.2 R14.2 R10.2 R4.2 R5.2 95.25,23.09 95.25,9.93 R7.2 R6.2 | 73.62,46.99 73.62,43.65 74.93,42.34 IC4.16 | 73.62,46.99 73.43,46.99 R11.2 | 73.46,22.02 74.93,22.02 IC6.16 | 73.46,22.02 72.39,23.09 R2.2 72.39,25.17 R3.2 69.85,26.67 C2.+ 59.46,34.29 58.19,35.56 C1.1 | JOVERRIDE.1 73.46,20.12 73.46,22.02 | R9.2 R8.2

### Text on the board
Top: TOPC
Bottom: CNC-CP-CB-20130528 | BOTC
tPlace: 1 | 1 | 1 | OSHW | 1 | 1 | 1 | 1 | CNC-CP-CB-20130528 | 1 | (C) 2013 Radu - Eosif Mihailescu | - | + | TOPS
bPlace: BOTS